# Altium schematic sheet fpga-bank4.SchDoc: Copper Suicide - FPGA - Bank 4
size Letter; CheckedBy: J. Brinton; CompanyName: Signal Laboratories, Inc.; DrawnBy: J. Brinton; Engineer: J. Brinton; Address1: 3479 Edison Way; Address2: Menlo Park CA 94025; Address3: +1 (877) 778-8435; Address4: siglabs.com; Revision: 3; SheetNumber: 9; SheetTotal: 47
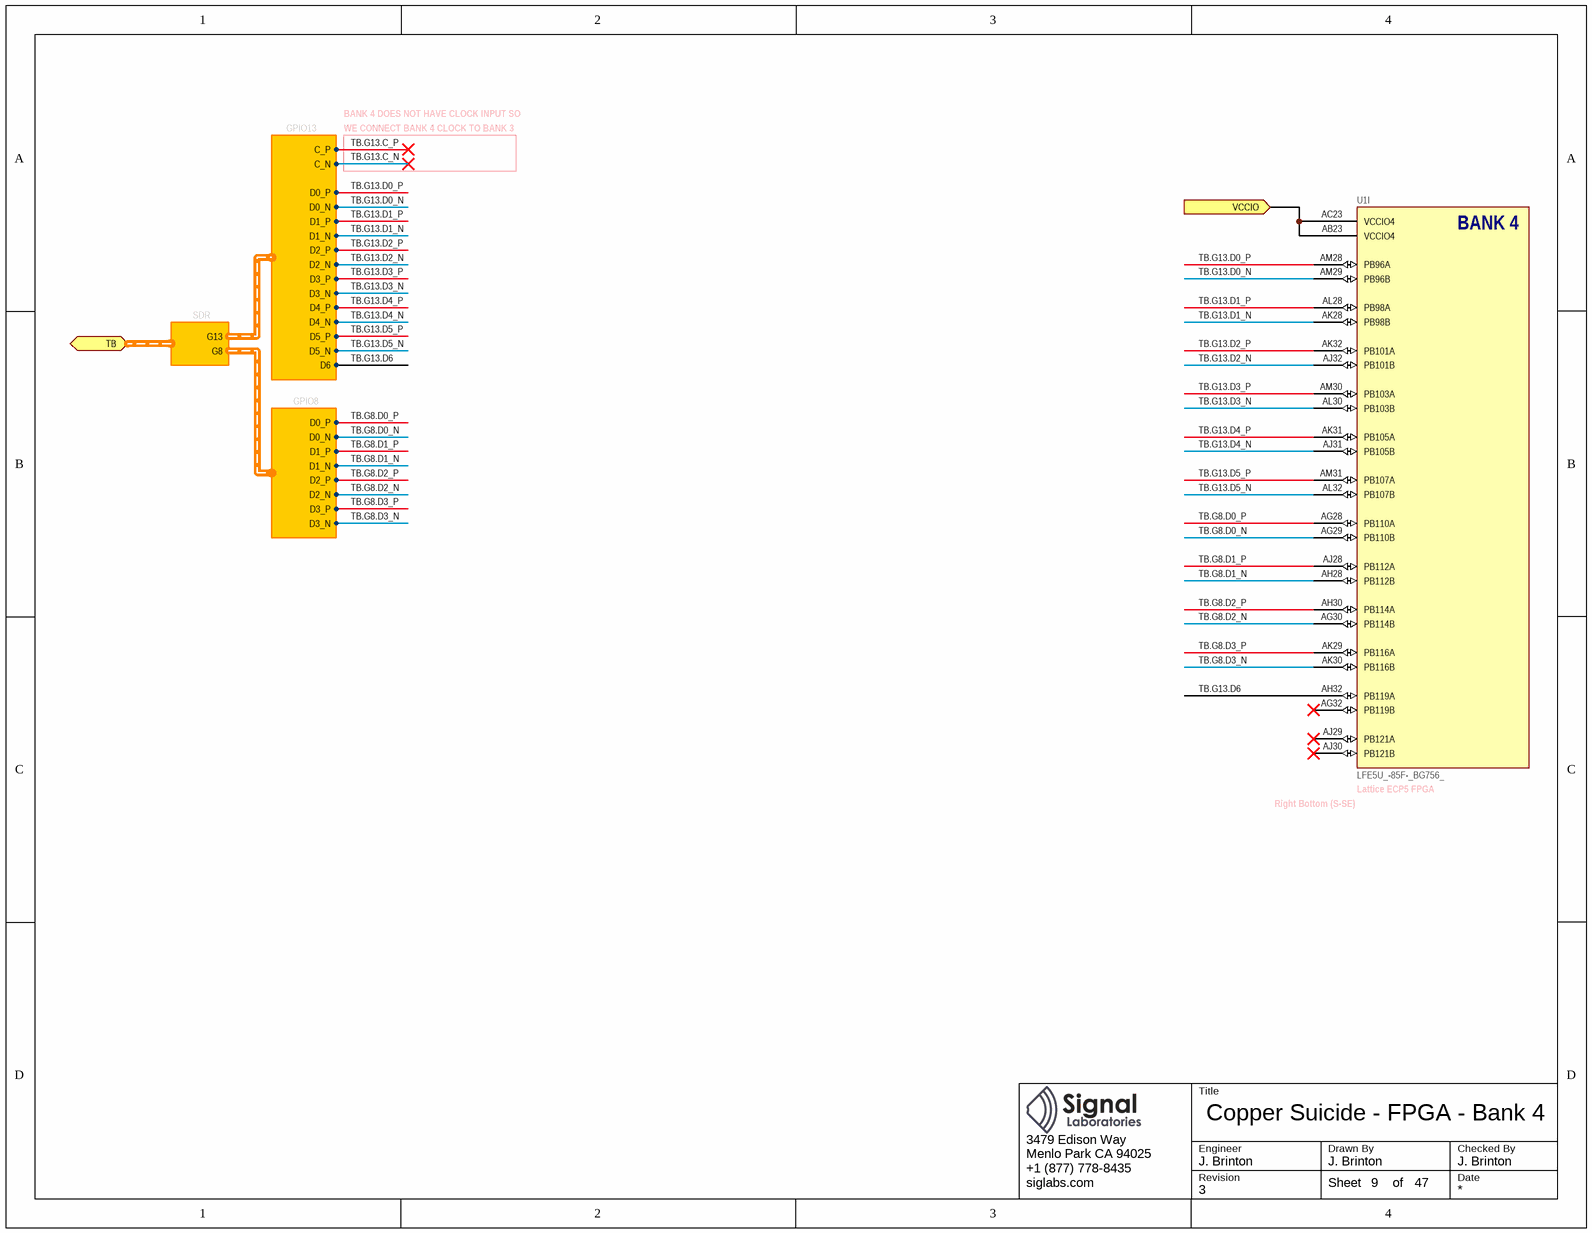
[diagram p0: fpga-bank4.SchDoc]

## Parts
U1  LFE5U_-85F-_BG756_  [caBGA756]  (part I of 19)

## Ports
TB (harness SDR), VCCIO (in)

## Harnesses
SDR: G13, G8
GPIO13: C_P, C_N, D0_P, D0_N, D1_P, D1_N, D2_P, D2_N, D3_P, D3_N, D4_P, D4_N, D5_P, D5_N, D6
GPIO8: D0_P, D0_N, D1_P, D1_N, D2_P, D2_N, D3_P, D3_N

## Nets
TB.G8.D0_N: U1.AG29(PB110B) ; harness GPIO8.D0_N
TB.G8.D0_P: U1.AG28(PB110A) ; harness GPIO8.D0_P
TB.G8.D1_N: U1.AH28(PB112B) ; harness GPIO8.D1_N
TB.G8.D1_P: U1.AJ28(PB112A) ; harness GPIO8.D1_P
TB.G8.D2_N: U1.AG30(PB114B) ; harness GPIO8.D2_N
TB.G8.D2_P: U1.AH30(PB114A) ; harness GPIO8.D2_P
TB.G8.D3_N: U1.AK30(PB116B) ; harness GPIO8.D3_N
TB.G8.D3_P: U1.AK29(PB116A) ; harness GPIO8.D3_P
TB.G13.C_N: harness GPIO13.C_N
TB.G13.C_P: harness GPIO13.C_P
TB.G13.D0_N: U1.AM29(PB96B) ; harness GPIO13.D0_N
TB.G13.D0_P: U1.AM28(PB96A) ; harness GPIO13.D0_P
TB.G13.D1_N: U1.AK28(PB98B) ; harness GPIO13.D1_N
TB.G13.D1_P: U1.AL28(PB98A) ; harness GPIO13.D1_P
TB.G13.D2_N: U1.AJ32(PB101B) ; harness GPIO13.D2_N
TB.G13.D2_P: U1.AK32(PB101A) ; harness GPIO13.D2_P
TB.G13.D3_N: U1.AL30(PB103B) ; harness GPIO13.D3_N
TB.G13.D3_P: U1.AM30(PB103A) ; harness GPIO13.D3_P
TB.G13.D4_N: U1.AJ31(PB105B) ; harness GPIO13.D4_N
TB.G13.D4_P: U1.AK31(PB105A) ; harness GPIO13.D4_P
TB.G13.D5_N: U1.AL32(PB107B) ; harness GPIO13.D5_N
TB.G13.D5_P: U1.AM31(PB107A) ; harness GPIO13.D5_P
TB.G13.D6: U1.AH32(PB119A) ; harness GPIO13.D6
VCCIO: U1.AB23(VCCIO4) U1.AC23(VCCIO4) ; port VCCIO

Not connected (* = marked no-connect by the designer): U1 AG32(PB119B)* AJ29(PB121A)* AJ30(PB121B)*

## Notes on the sheet
- BANK 4 DOES NOT HAVE CLOCK INPUT SO
- WE CONNECT BANK 4 CLOCK TO BANK 3
- (near U1) Right Bottom (S-SE)
- (near U1) Lattice ECP5 FPGA
- Title
- Engineer
- Revision
- Drawn By
- Checked By
- Date
- Sheet
- of
- (in symbol LFE5U_-85F-_BG756_, part I) BANK 4

## Library data of the parts
U1 = LFE5U_-85F-_BG756_: ECP5 FPGA, 85k LUT, 756-caBGA; Manufacturer: Lattice Semiconductor; Manufacturer P/N: LFE5U_-85F-_BG756_